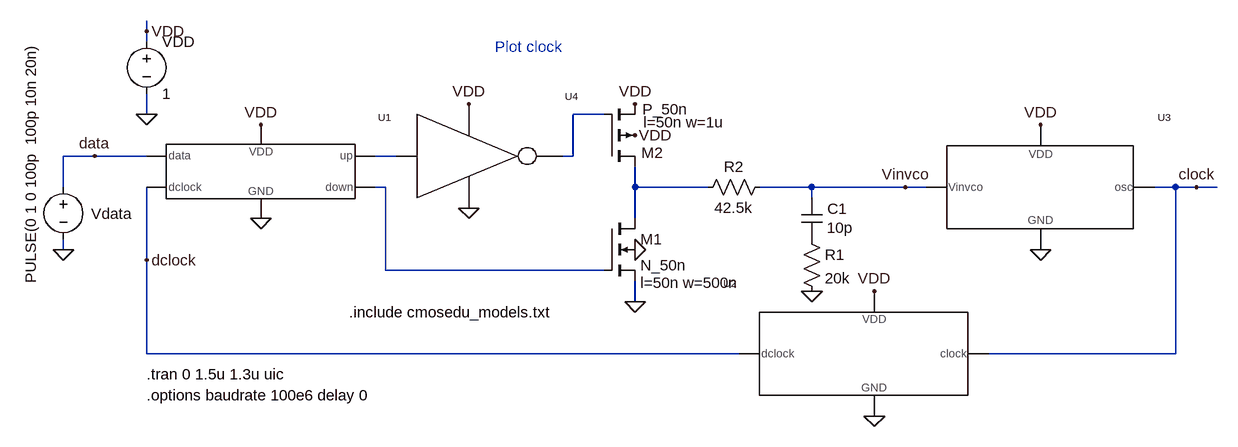
[diagram p0: schematic Fig19_35_eye_diagram.asc]
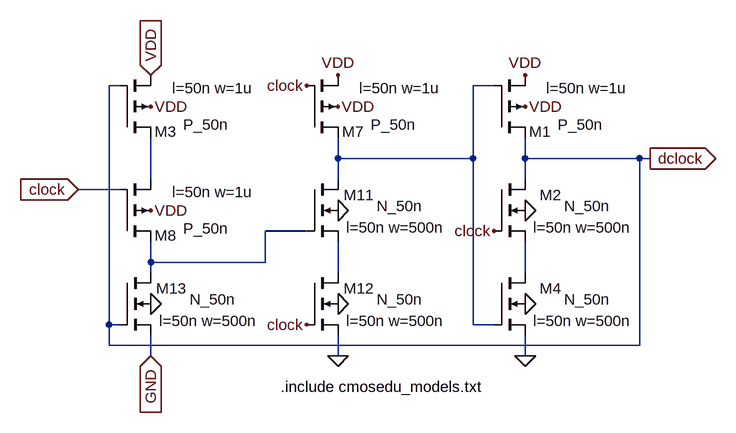
[diagram p1: sub-circuit divide_by_2.asc]
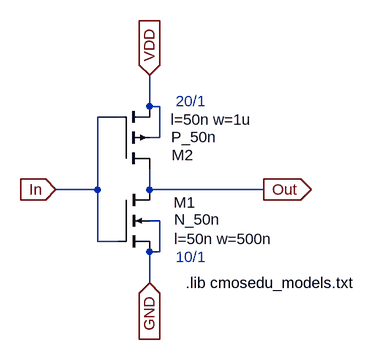
[diagram p2: sub-circuit inv_20_10.asc]
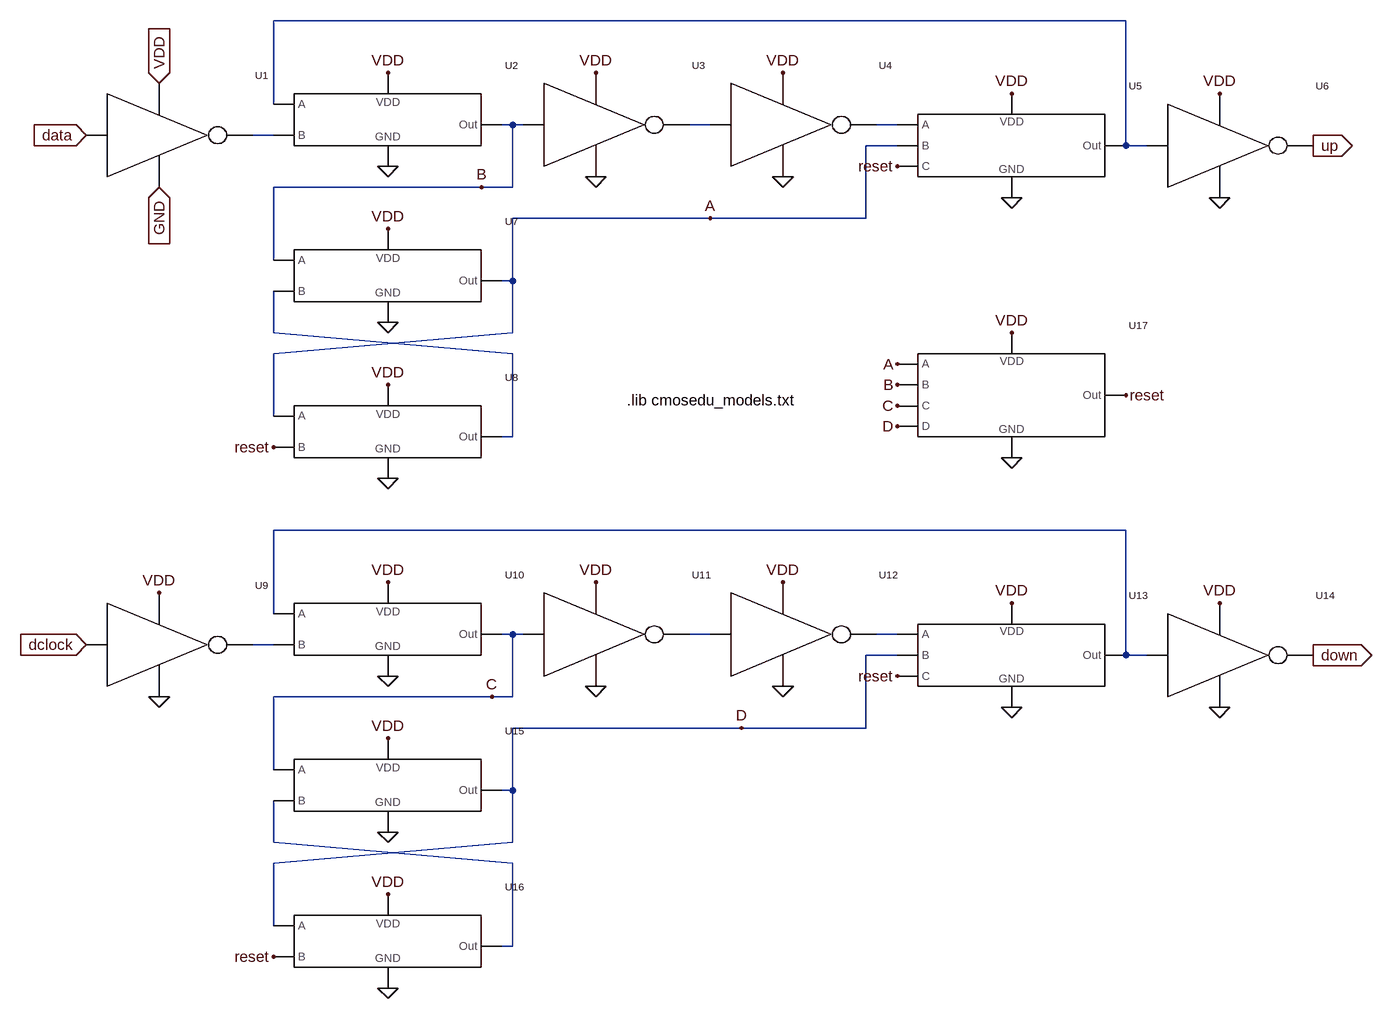
[diagram p3: sub-circuit pfd.asc]
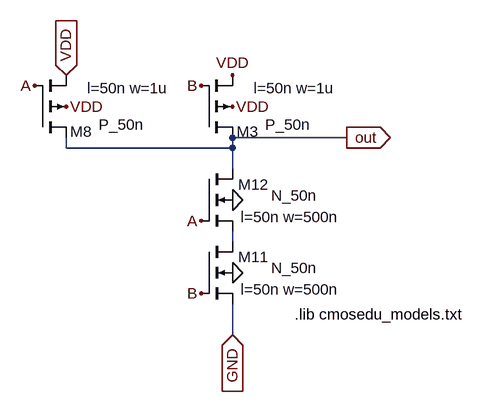
[diagram p4: sub-circuit nand_2.asc]
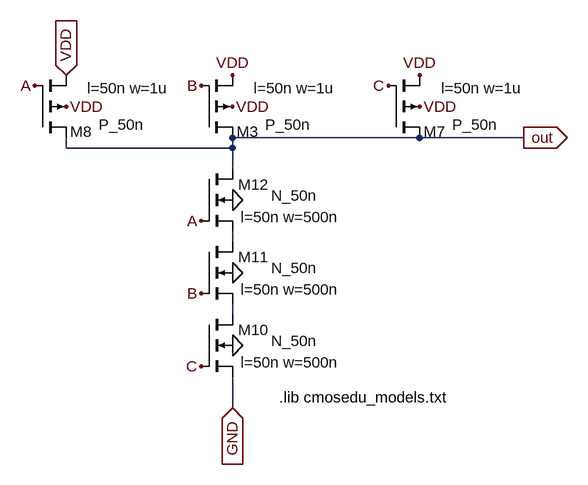
[diagram p5: sub-circuit nand_3.asc]
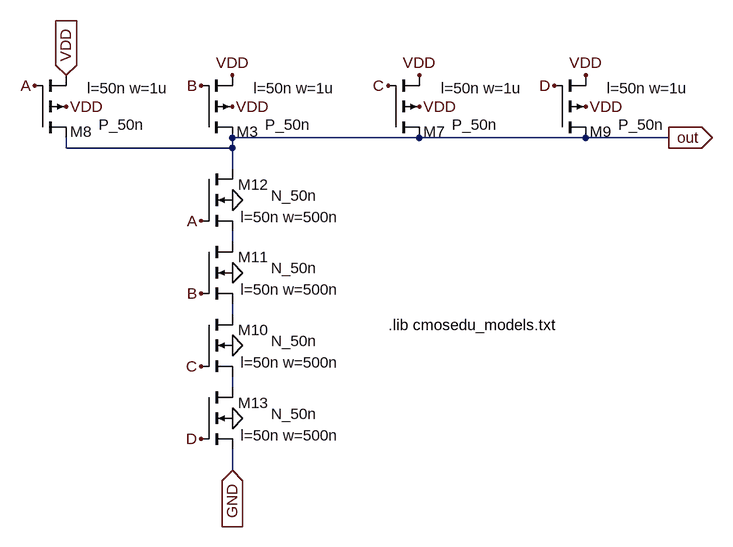
[diagram p6: sub-circuit nand_4.asc]
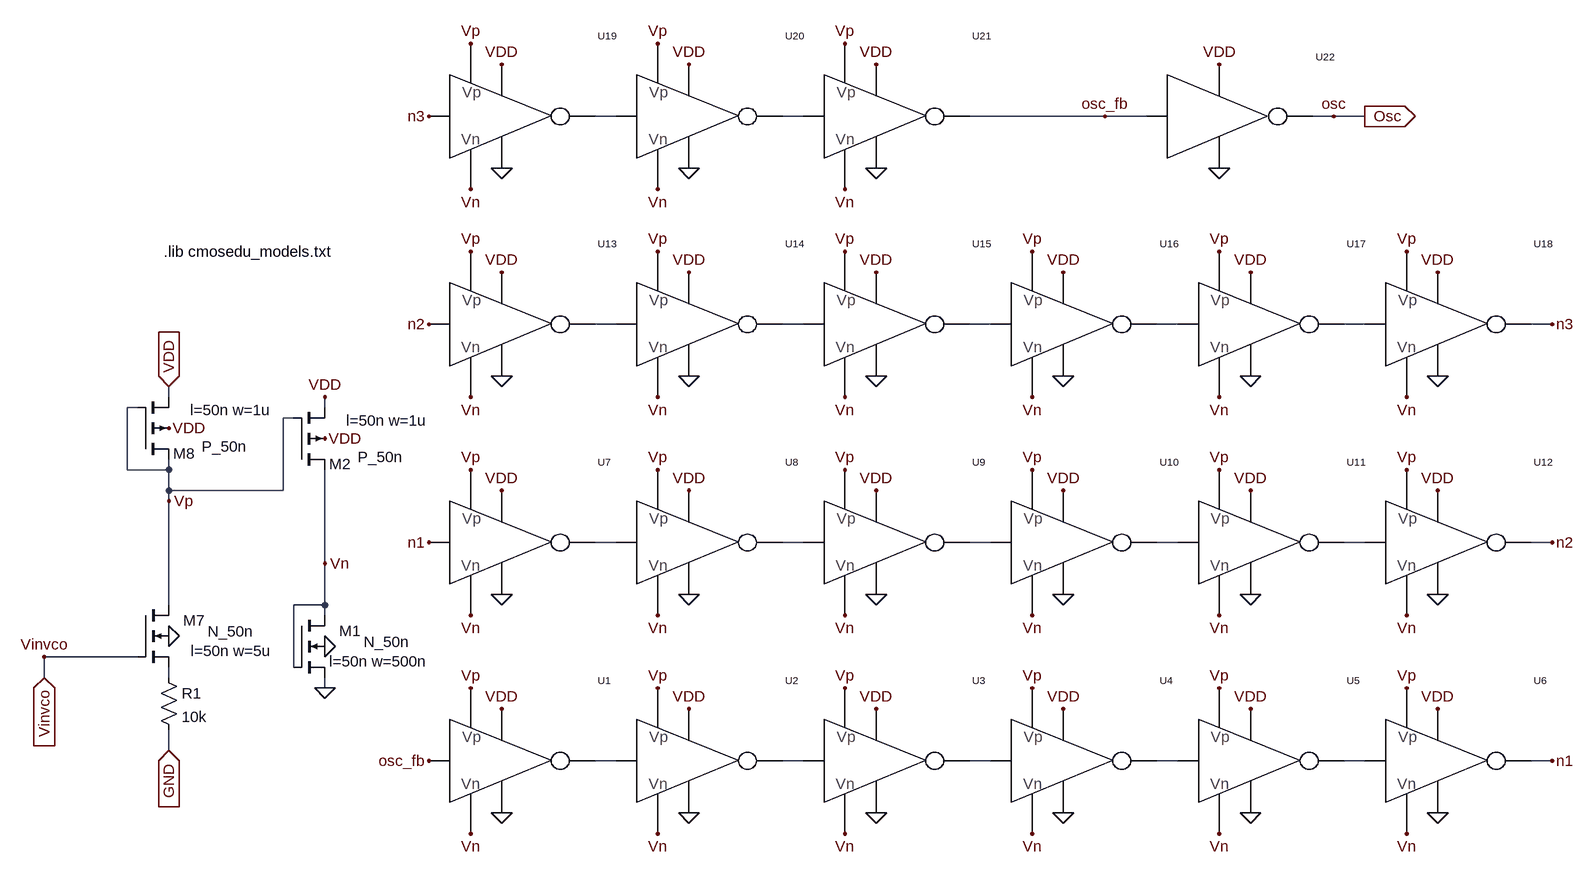
[diagram p7: sub-circuit vco_19_18.asc]
Fig19_35_eye_diagram.asc, the LTspice schematic file:
Version 4
SHEET 1 6288 680
WIRE 1232 -880 1232 -896
WIRE 1232 -864 1232 -880
WIRE 1232 -752 1232 -784
WIRE 1936 -752 1888 -752
WIRE 1152 -688 1104 -688
WIRE 1232 -688 1152 -688
WIRE 1616 -688 1584 -688
WIRE 1888 -688 1888 -752
WIRE 1888 -688 1872 -688
WIRE 1104 -640 1104 -688
WIRE 1600 -640 1584 -640
WIRE 1984 -640 1984 -672
WIRE 2096 -640 1984 -640
WIRE 2256 -640 2176 -640
WIRE 2400 -640 2256 -640
WIRE 2432 -640 2400 -640
WIRE 2816 -640 2784 -640
WIRE 2848 -640 2816 -640
WIRE 2880 -640 2848 -640
WIRE 2256 -624 2256 -640
WIRE 1984 -592 1984 -640
WIRE 1104 -544 1104 -560
WIRE 1232 -528 1232 -640
WIRE 1600 -512 1600 -640
WIRE 1936 -512 1600 -512
WIRE 1984 -464 1984 -496
WIRE 1232 -384 1232 -528
WIRE 2144 -384 1232 -384
WIRE 2816 -384 2816 -640
WIRE 2816 -384 2528 -384
FLAG 1104 -544 0
FLAG 1232 -752 0
FLAG 1232 -880 VDD
FLAG 1408 -736 VDD
FLAG 1408 -592 0
FLAG 1152 -688 data
FLAG 1232 -528 dclock
FLAG 2352 -480 VDD
FLAG 2352 -288 0
FLAG 2608 -544 0
FLAG 2608 -736 VDD
FLAG 2848 -640 clock
FLAG 2400 -640 Vinvco
FLAG 1728 -768 VDD
FLAG 1728 -608 0
FLAG 1984 -544 0
FLAG 1984 -464 0
FLAG 1984 -768 VDD
FLAG 1984 -720 VDD
FLAG 2256 -480 0
SYMBOL voltage 1104 -656 R0
WINDOW 0 43 57 Left 2
WINDOW 3 -50 164 VLeft 2
WINDOW 123 0 0 Left 2
WINDOW 39 0 0 Left 2
SYMATTR InstName Vdata
SYMATTR Value PULSE(0 1 0 100p  100p 10n 20n)
SYMBOL voltage 1232 -880 R0
WINDOW 123 0 0 Left 2
WINDOW 39 0 0 Left 2
SYMATTR InstName VDD
SYMATTR Value 1
SYMBOL divide_by_2 2576 -384 M0
SYMATTR InstName U2
SYMBOL INV_20_10 1648 -752 R0
SYMATTR InstName U4
SYMBOL PFD 1184 -640 R0
SYMATTR InstName U1
SYMBOL VCO_19_18 2384 -640 R0
SYMATTR InstName U3
SYMBOL nmos4 1936 -592 R0
WINDOW 123 56 99 Left 2
SYMATTR Value2 l=50n w=500n
SYMATTR InstName M1
SYMATTR Value N_50n
SYMBOL pmos4 1936 -672 M180
WINDOW 0 58 21 Left 2
WINDOW 3 59 88 Left 2
WINDOW 123 61 68 Left 2
SYMATTR InstName M2
SYMATTR Value P_50n
SYMATTR Value2 l=50n w=1u
SYMBOL cap 2240 -624 R0
WINDOW 0 40 17 Left 2
WINDOW 3 39 46 Left 2
SYMATTR InstName C1
SYMATTR Value 10p
SYMBOL res 2240 -576 R0
SYMATTR InstName R1
SYMATTR Value 20k
SYMBOL res 2192 -656 R90
WINDOW 0 0 56 VBottom 2
WINDOW 3 32 56 VTop 2
SYMATTR InstName R2
SYMATTR Value 42.5k
TEXT 1232 -352 Left 2 !.tran 0 1.5u 1.3u uic
TEXT 1768 -856 Left 2 ;Plot clock
TEXT 1544 -448 Left 2 !.include cmosedu_models.txt
TEXT 1232 -320 Left 2 !.options baudrate 100e6 delay 0

divide_by_2.asc, the sub-circuit schematic file:
Version 4
SHEET 1 6288 680
WIRE 1120 -496 1104 -496
WIRE 1696 -496 1664 -496
WIRE 1456 -384 1456 -416
WIRE 1664 -384 1664 -496
WIRE 1664 -384 1456 -384
WIRE 1744 -384 1744 -416
WIRE 1920 -384 1744 -384
WIRE 1936 -384 1920 -384
WIRE 1168 -352 1168 -416
WIRE 1456 -352 1456 -384
WIRE 1744 -352 1744 -384
WIRE 1120 -336 1056 -336
WIRE 1408 -272 1344 -272
WIRE 1168 -224 1168 -256
WIRE 1344 -224 1344 -272
WIRE 1344 -224 1168 -224
WIRE 1168 -208 1168 -224
WIRE 1456 -208 1456 -256
WIRE 1744 -208 1744 -256
WIRE 1104 -128 1104 -496
WIRE 1120 -128 1104 -128
WIRE 1664 -128 1664 -384
WIRE 1696 -128 1664 -128
WIRE 1104 -96 1104 -128
WIRE 1920 -96 1920 -384
WIRE 1920 -96 1104 -96
WIRE 1168 -80 1168 -112
WIRE 1456 -80 1456 -112
WIRE 1744 -80 1744 -112
FLAG 1168 -464 VDD
FLAG 1456 -80 0
FLAG 1456 -464 VDD
FLAG 1168 -304 VDD
FLAG 1456 -304 0
FLAG 1456 -160 0
FLAG 1168 -160 0
FLAG 1456 -512 VDD
FLAG 1168 -512 VDD
IOPIN 1168 -512 In
FLAG 1168 -80 GND
IOPIN 1168 -80 In
FLAG 1744 -80 0
FLAG 1744 -464 VDD
FLAG 1744 -304 0
FLAG 1744 -160 0
FLAG 1744 -512 VDD
FLAG 1936 -384 dclock
IOPIN 1936 -384 Out
FLAG 1056 -336 clock
IOPIN 1056 -336 In
FLAG 1408 -496 clock
FLAG 1408 -128 clock
FLAG 1696 -272 clock
SYMBOL pmos4 1120 -416 M180
WINDOW 0 88 9 Right 0
WINDOW 3 168 20 Right 0
WINDOW 123 206 76 Right 0
SYMATTR InstName M3
SYMATTR Value P_50n
SYMATTR Value2 l=50n w=1u
SYMBOL pmos4 1408 -416 M180
WINDOW 0 88 9 Right 0
WINDOW 3 168 20 Right 0
WINDOW 123 206 76 Right 0
SYMATTR InstName M7
SYMATTR Value P_50n
SYMATTR Value2 l=50n w=1u
SYMBOL pmos4 1120 -256 M180
WINDOW 0 88 9 Right 0
WINDOW 3 168 20 Right 0
WINDOW 123 206 76 Right 0
SYMATTR InstName M8
SYMATTR Value P_50n
SYMATTR Value2 l=50n w=1u
SYMBOL nmos4 1408 -352 R0
WINDOW 0 104 24 Right 0
WINDOW 3 179 41 Right 0
WINDOW 123 213 74 Right 0
SYMATTR InstName M11
SYMATTR Value N_50n
SYMATTR Value2 l=50n w=500n
SYMBOL nmos4 1408 -208 R0
WINDOW 0 104 24 Right 0
WINDOW 3 179 41 Right 0
WINDOW 123 213 74 Right 0
SYMATTR InstName M12
SYMATTR Value N_50n
SYMATTR Value2 l=50n w=500n
SYMBOL nmos4 1120 -208 R0
WINDOW 0 104 24 Right 0
WINDOW 3 179 41 Right 0
WINDOW 123 213 74 Right 0
SYMATTR InstName M13
SYMATTR Value N_50n
SYMATTR Value2 l=50n w=500n
SYMBOL pmos4 1696 -416 M180
WINDOW 0 88 9 Right 0
WINDOW 3 168 20 Right 0
WINDOW 123 206 76 Right 0
SYMATTR InstName M1
SYMATTR Value P_50n
SYMATTR Value2 l=50n w=1u
SYMBOL nmos4 1696 -352 R0
WINDOW 0 104 24 Right 0
WINDOW 3 179 41 Right 0
WINDOW 123 213 74 Right 0
SYMATTR InstName M2
SYMATTR Value N_50n
SYMATTR Value2 l=50n w=500n
SYMBOL nmos4 1696 -208 R0
WINDOW 0 104 24 Right 0
WINDOW 3 179 41 Right 0
WINDOW 123 213 74 Right 0
SYMATTR InstName M4
SYMATTR Value N_50n
SYMATTR Value2 l=50n w=500n
TEXT 1368 -32 Left 0 !.include cmosedu_models.txt

inv_20_10.asc, the sub-circuit schematic file:
Version 4
SHEET 1 1136 680
WIRE 448 -304 448 -352
WIRE 464 -304 448 -304
WIRE 400 -288 368 -288
WIRE 464 -256 464 -304
WIRE 464 -256 448 -256
WIRE 368 -176 368 -288
WIRE 368 -176 304 -176
WIRE 448 -176 448 -208
WIRE 624 -176 448 -176
WIRE 464 -128 448 -128
WIRE 368 -96 368 -176
WIRE 400 -96 368 -96
WIRE 464 -80 464 -128
WIRE 464 -80 448 -80
WIRE 448 -32 448 -80
FLAG 304 -176 In
IOPIN 304 -176 In
FLAG 448 -352 VDD
IOPIN 448 -352 In
FLAG 448 -32 GND
IOPIN 448 -32 In
FLAG 624 -176 Out
IOPIN 624 -176 Out
SYMBOL nmos4 400 -176 R0
WINDOW 0 119 20 Right 2
WINDOW 3 157 46 Right 2
WINDOW 123 238 76 Right 2
SYMATTR InstName M1
SYMATTR Value N_50n
SYMATTR Value2 l=50n w=500n
SYMBOL pmos4 400 -208 M180
WINDOW 0 116 21 Right 2
WINDOW 3 151 49 Right 2
WINDOW 123 206 76 Right 2
SYMATTR InstName M2
SYMATTR Value P_50n
SYMATTR Value2 l=50n w=1u
TEXT 488 -312 Left 2 ;20/1
TEXT 488 -72 Left 2 ;10/1
TEXT 504 -32 Left 2 !.lib cmosedu_models.txt

pfd.asc, the sub-circuit schematic file:
Version 4
SHEET 1 6296 1412
WIRE 1280 32 1280 -96
WIRE 1280 80 1248 80
WIRE 1280 272 1280 160
WIRE 1280 384 1280 320
WIRE 1280 512 1280 416
WIRE 1280 816 1280 688
WIRE 1280 864 1248 864
WIRE 1280 1056 1280 944
WIRE 1280 1168 1280 1104
WIRE 1280 1296 1280 1200
WIRE 1600 160 1280 160
WIRE 1616 944 1280 944
WIRE 1648 64 1632 64
WIRE 1648 160 1600 160
WIRE 1648 160 1648 64
WIRE 1648 304 1632 304
WIRE 1648 304 1648 208
WIRE 1648 384 1280 416
WIRE 1648 384 1648 304
WIRE 1648 416 1280 384
WIRE 1648 544 1632 544
WIRE 1648 544 1648 416
WIRE 1648 848 1632 848
WIRE 1648 944 1616 944
WIRE 1648 944 1648 848
WIRE 1648 1088 1632 1088
WIRE 1648 1088 1648 992
WIRE 1648 1168 1280 1200
WIRE 1648 1168 1648 1088
WIRE 1648 1200 1280 1168
WIRE 1648 1328 1632 1328
WIRE 1648 1328 1648 1200
WIRE 1664 64 1648 64
WIRE 1664 848 1648 848
WIRE 1952 64 1920 64
WIRE 1952 208 1648 208
WIRE 1952 848 1920 848
WIRE 2000 992 1648 992
WIRE 2192 208 1952 208
WIRE 2192 208 2192 96
WIRE 2192 992 2000 992
WIRE 2192 992 2192 880
WIRE 2240 64 2208 64
WIRE 2240 96 2192 96
WIRE 2240 848 2208 848
WIRE 2240 880 2192 880
WIRE 2592 -96 1280 -96
WIRE 2592 96 2592 -96
WIRE 2592 688 1280 688
WIRE 2592 880 2592 688
WIRE 2624 96 2592 96
WIRE 2624 880 2592 880
FLAG 1104 0 VDD
IOPIN 1104 0 In
FLAG 992 80 data
IOPIN 992 80 In
FLAG 1456 -16 VDD
FLAG 1456 128 0
FLAG 1776 144 0
FLAG 2064 144 0
FLAG 2416 16 VDD
FLAG 1776 -16 VDD
FLAG 2064 -16 VDD
FLAG 2416 176 0
FLAG 2736 176 0
FLAG 2736 16 VDD
FLAG 2880 96 up
IOPIN 2880 96 Out
FLAG 1456 368 0
FLAG 1456 608 0
FLAG 1456 224 VDD
FLAG 1456 464 VDD
FLAG 1280 560 reset
FLAG 1104 160 GND
IOPIN 1104 160 In
FLAG 992 864 dclock
IOPIN 992 864 In
FLAG 1456 768 VDD
FLAG 1456 912 0
FLAG 1776 928 0
FLAG 2064 928 0
FLAG 2416 800 VDD
FLAG 1776 768 VDD
FLAG 2064 768 VDD
FLAG 2416 960 0
FLAG 2736 960 0
FLAG 2736 800 VDD
FLAG 2880 880 down
IOPIN 2880 880 Out
FLAG 1456 1152 0
FLAG 1456 1392 0
FLAG 1456 1008 VDD
FLAG 1456 1248 VDD
FLAG 1280 1344 reset
FLAG 1104 944 0
FLAG 1104 784 VDD
FLAG 2240 128 reset
FLAG 2240 912 reset
FLAG 2592 480 reset
FLAG 2416 576 0
FLAG 2416 384 VDD
FLAG 1952 208 A
FLAG 1600 160 B
FLAG 1616 944 C
FLAG 2240 496 C
FLAG 2240 432 A
FLAG 2240 464 B
FLAG 2000 992 D
FLAG 2240 528 D
SYMBOL INV_20_10 1024 16 R0
SYMATTR InstName U1
SYMBOL NAND_2 1232 80 R0
SYMATTR InstName U2
SYMBOL INV_20_10 1696 0 R0
SYMATTR InstName U3
SYMBOL INV_20_10 1984 0 R0
SYMATTR InstName U4
SYMBOL NAND_3 2192 112 R0
SYMATTR InstName U5
SYMBOL INV_20_10 2656 32 R0
SYMATTR InstName U6
SYMBOL NAND_2 1232 320 R0
SYMATTR InstName U7
SYMBOL NAND_2 1232 560 R0
SYMATTR InstName U8
SYMBOL INV_20_10 1024 800 R0
SYMATTR InstName U9
SYMBOL NAND_2 1232 864 R0
SYMATTR InstName U10
SYMBOL INV_20_10 1696 784 R0
SYMATTR InstName U11
SYMBOL INV_20_10 1984 784 R0
SYMATTR InstName U12
SYMBOL NAND_3 2192 896 R0
SYMATTR InstName U13
SYMBOL INV_20_10 2656 816 R0
SYMATTR InstName U14
SYMBOL NAND_2 1232 1104 R0
SYMATTR InstName U15
SYMBOL NAND_2 1232 1344 R0
SYMATTR InstName U16
SYMBOL NAND_4 2192 480 R0
SYMATTR InstName U17
TEXT 1824 488 Left 0 !.lib cmosedu_models.txt

nand_2.asc, the sub-circuit schematic file:
Version 4
SHEET 1 6288 680
WIRE 912 -400 912 -416
WIRE 1168 -400 912 -400
WIRE 1168 -400 1168 -416
WIRE 1168 -368 1168 -400
WIRE 1168 -256 1168 -272
WIRE 1168 -112 1168 -160
WIRE 1344 -416 1168 -416
FLAG 1168 -464 VDD
FLAG 912 -464 VDD
FLAG 1168 -208 0
FLAG 1168 -320 0
FLAG 1168 -512 VDD
FLAG 912 -512 VDD
IOPIN 912 -512 In
FLAG 1168 -112 GND
IOPIN 1168 -112 In
FLAG 1344 -416 out
IOPIN 1344 -416 Out
FLAG 864 -496 A
FLAG 1120 -288 A
FLAG 1120 -496 B
FLAG 1120 -176 B
SYMBOL pmos4 1120 -416 M180
WINDOW 0 88 9 Right 0
WINDOW 3 168 20 Right 0
WINDOW 123 206 76 Right 0
SYMATTR InstName M3
SYMATTR Value P_50n
SYMATTR Value2 l=50n w=1u
SYMBOL pmos4 864 -416 M180
WINDOW 0 88 9 Right 0
WINDOW 3 168 20 Right 0
WINDOW 123 206 76 Right 0
SYMATTR InstName M8
SYMATTR Value P_50n
SYMATTR Value2 l=50n w=1u
SYMBOL nmos4 1120 -256 R0
WINDOW 0 104 24 Right 0
WINDOW 3 179 41 Right 0
WINDOW 123 213 74 Right 0
SYMATTR InstName M11
SYMATTR Value N_50n
SYMATTR Value2 l=50n w=500n
SYMBOL nmos4 1120 -368 R0
WINDOW 0 104 24 Right 0
WINDOW 3 179 41 Right 0
WINDOW 123 213 74 Right 0
SYMATTR InstName M12
SYMATTR Value N_50n
SYMATTR Value2 l=50n w=500n
TEXT 1264 -144 Left 0 !.lib cmosedu_models.txt

nand_3.asc, the sub-circuit schematic file:
Version 4
SHEET 1 6288 680
WIRE 912 -400 912 -416
WIRE 1168 -400 912 -400
WIRE 1168 -400 1168 -416
WIRE 1168 -368 1168 -400
WIRE 1168 -256 1168 -272
WIRE 1168 -144 1168 -160
WIRE 1168 0 1168 -48
WIRE 1456 -416 1168 -416
WIRE 1616 -416 1456 -416
FLAG 1168 -464 VDD
FLAG 1456 -464 VDD
FLAG 912 -464 VDD
FLAG 1168 -96 0
FLAG 1168 -208 0
FLAG 1168 -320 0
FLAG 1168 -512 VDD
FLAG 1456 -512 VDD
FLAG 912 -512 VDD
IOPIN 912 -512 In
FLAG 1168 0 GND
IOPIN 1168 0 In
FLAG 1616 -416 out
IOPIN 1616 -416 Out
FLAG 864 -496 A
FLAG 1120 -288 A
FLAG 1120 -496 B
FLAG 1120 -176 B
FLAG 1408 -496 C
FLAG 1120 -64 C
SYMBOL pmos4 1120 -416 M180
WINDOW 0 88 9 Right 0
WINDOW 3 168 20 Right 0
WINDOW 123 206 76 Right 0
SYMATTR InstName M3
SYMATTR Value P_50n
SYMATTR Value2 l=50n w=1u
SYMBOL pmos4 1408 -416 M180
WINDOW 0 88 9 Right 0
WINDOW 3 168 20 Right 0
WINDOW 123 206 76 Right 0
SYMATTR InstName M7
SYMATTR Value P_50n
SYMATTR Value2 l=50n w=1u
SYMBOL pmos4 864 -416 M180
WINDOW 0 88 9 Right 0
WINDOW 3 168 20 Right 0
WINDOW 123 206 76 Right 0
SYMATTR InstName M8
SYMATTR Value P_50n
SYMATTR Value2 l=50n w=1u
SYMBOL nmos4 1120 -144 R0
WINDOW 0 104 24 Right 0
WINDOW 3 179 41 Right 0
WINDOW 123 213 74 Right 0
SYMATTR InstName M10
SYMATTR Value N_50n
SYMATTR Value2 l=50n w=500n
SYMBOL nmos4 1120 -256 R0
WINDOW 0 104 24 Right 0
WINDOW 3 179 41 Right 0
WINDOW 123 213 74 Right 0
SYMATTR InstName M11
SYMATTR Value N_50n
SYMATTR Value2 l=50n w=500n
SYMBOL nmos4 1120 -368 R0
WINDOW 0 104 24 Right 0
WINDOW 3 179 41 Right 0
WINDOW 123 213 74 Right 0
SYMATTR InstName M12
SYMATTR Value N_50n
SYMATTR Value2 l=50n w=500n
TEXT 1240 -16 Left 0 !.lib cmosedu_models.txt

nand_4.asc, the sub-circuit schematic file:
Version 4
SHEET 1 6288 680
WIRE 912 -400 912 -416
WIRE 1168 -400 912 -400
WIRE 1168 -400 1168 -416
WIRE 1168 -368 1168 -400
WIRE 1168 -256 1168 -272
WIRE 1168 -144 1168 -160
WIRE 1168 -32 1168 -48
WIRE 1168 96 1168 64
WIRE 1456 -416 1168 -416
WIRE 1712 -416 1456 -416
WIRE 1840 -416 1712 -416
FLAG 1168 -464 VDD
FLAG 1456 -464 VDD
FLAG 912 -464 VDD
FLAG 1712 -464 VDD
FLAG 1168 -96 0
FLAG 1168 -208 0
FLAG 1168 -320 0
FLAG 1168 16 0
FLAG 1168 -512 VDD
FLAG 1456 -512 VDD
FLAG 1712 -512 VDD
FLAG 912 -512 VDD
IOPIN 912 -512 In
FLAG 1168 96 GND
IOPIN 1168 96 In
FLAG 1840 -416 out
IOPIN 1840 -416 Out
FLAG 864 -496 A
FLAG 1120 -288 A
FLAG 1120 -496 B
FLAG 1120 -176 B
FLAG 1408 -496 C
FLAG 1120 -64 C
FLAG 1664 -496 D
FLAG 1120 48 D
SYMBOL pmos4 1120 -416 M180
WINDOW 0 88 9 Right 0
WINDOW 3 168 20 Right 0
WINDOW 123 206 76 Right 0
SYMATTR InstName M3
SYMATTR Value P_50n
SYMATTR Value2 l=50n w=1u
SYMBOL pmos4 1408 -416 M180
WINDOW 0 88 9 Right 0
WINDOW 3 168 20 Right 0
WINDOW 123 206 76 Right 0
SYMATTR InstName M7
SYMATTR Value P_50n
SYMATTR Value2 l=50n w=1u
SYMBOL pmos4 864 -416 M180
WINDOW 0 88 9 Right 0
WINDOW 3 168 20 Right 0
WINDOW 123 206 76 Right 0
SYMATTR InstName M8
SYMATTR Value P_50n
SYMATTR Value2 l=50n w=1u
SYMBOL pmos4 1664 -416 M180
WINDOW 0 88 9 Right 0
WINDOW 3 168 20 Right 0
WINDOW 123 206 76 Right 0
SYMATTR InstName M9
SYMATTR Value P_50n
SYMATTR Value2 l=50n w=1u
SYMBOL nmos4 1120 -144 R0
WINDOW 0 104 24 Right 0
WINDOW 3 179 41 Right 0
WINDOW 123 213 74 Right 0
SYMATTR InstName M10
SYMATTR Value N_50n
SYMATTR Value2 l=50n w=500n
SYMBOL nmos4 1120 -256 R0
WINDOW 0 104 24 Right 0
WINDOW 3 179 41 Right 0
WINDOW 123 213 74 Right 0
SYMATTR InstName M11
SYMATTR Value N_50n
SYMATTR Value2 l=50n w=500n
SYMBOL nmos4 1120 -368 R0
WINDOW 0 104 24 Right 0
WINDOW 3 179 41 Right 0
WINDOW 123 213 74 Right 0
SYMATTR InstName M12
SYMATTR Value N_50n
SYMATTR Value2 l=50n w=500n
SYMBOL nmos4 1120 -32 R0
WINDOW 0 104 24 Right 0
WINDOW 3 179 41 Right 0
WINDOW 123 213 74 Right 0
SYMATTR InstName M13
SYMATTR Value N_50n
SYMATTR Value2 l=50n w=500n
TEXT 1408 -128 Left 0 !.lib cmosedu_models.txt

vco_19_18.asc, the sub-circuit schematic file:
Version 4
SHEET 1 6288 680
WIRE 416 -528 416 -560
WIRE 544 -848 544 -944
WIRE 560 -944 544 -944
WIRE 560 -560 416 -560
WIRE 608 -960 608 -976
WIRE 608 -848 544 -848
WIRE 608 -848 608 -864
WIRE 608 -816 608 -848
WIRE 608 -800 608 -816
WIRE 608 -640 608 -800
WIRE 608 -528 608 -544
WIRE 608 -416 608 -448
WIRE 784 -816 608 -816
WIRE 784 -816 784 -928
WIRE 800 -928 784 -928
WIRE 800 -544 800 -640
WIRE 848 -944 848 -960
WIRE 848 -704 848 -848
WIRE 848 -640 800 -640
WIRE 848 -640 848 -704
WIRE 848 -624 848 -640
WIRE 848 -512 848 -528
WIRE 1296 -1392 1264 -1392
WIRE 1296 -1072 1264 -1072
WIRE 1296 -736 1264 -736
WIRE 1296 -400 1264 -400
WIRE 1584 -1392 1552 -1392
WIRE 1584 -1072 1552 -1072
WIRE 1584 -736 1552 -736
WIRE 1584 -400 1552 -400
WIRE 1872 -1072 1840 -1072
WIRE 1872 -736 1840 -736
WIRE 1872 -400 1840 -400
WIRE 2048 -1392 1840 -1392
WIRE 2112 -1392 2048 -1392
WIRE 2160 -1072 2128 -1072
WIRE 2160 -736 2128 -736
WIRE 2160 -400 2128 -400
WIRE 2400 -1392 2368 -1392
WIRE 2448 -1392 2400 -1392
WIRE 2448 -1072 2416 -1072
WIRE 2448 -736 2416 -736
WIRE 2448 -400 2416 -400
WIRE 2736 -1072 2704 -1072
WIRE 2736 -736 2704 -736
WIRE 2736 -400 2704 -400
FLAG 416 -560 Vinvco
FLAG 608 -592 0
FLAG 608 -912 VDD
FLAG 608 -800 Vp
FLAG 1120 -480 VDD
FLAG 1120 -320 0
FLAG 1072 -512 Vp
FLAG 1072 -288 Vn
FLAG 1408 -480 VDD
FLAG 1408 -320 0
FLAG 1360 -512 Vp
FLAG 1360 -288 Vn
FLAG 1696 -480 VDD
FLAG 1696 -320 0
FLAG 1648 -512 Vp
FLAG 1648 -288 Vn
FLAG 1984 -480 VDD
FLAG 1984 -320 0
FLAG 1936 -512 Vp
FLAG 1936 -288 Vn
FLAG 2272 -480 VDD
FLAG 2272 -320 0
FLAG 2224 -512 Vp
FLAG 2224 -288 Vn
FLAG 2560 -480 VDD
FLAG 2560 -320 0
FLAG 2512 -512 Vp
FLAG 2512 -288 Vn
FLAG 1120 -816 VDD
FLAG 1120 -656 0
FLAG 1072 -848 Vp
FLAG 1072 -624 Vn
FLAG 1408 -816 VDD
FLAG 1408 -656 0
FLAG 1360 -848 Vp
FLAG 1360 -624 Vn
FLAG 1696 -816 VDD
FLAG 1696 -656 0
FLAG 1648 -848 Vp
FLAG 1648 -624 Vn
FLAG 1984 -816 VDD
FLAG 1984 -656 0
FLAG 1936 -848 Vp
FLAG 1936 -624 Vn
FLAG 2272 -816 VDD
FLAG 2272 -656 0
FLAG 2224 -848 Vp
FLAG 2224 -624 Vn
FLAG 2560 -816 VDD
FLAG 2560 -656 0
FLAG 2512 -848 Vp
FLAG 2512 -624 Vn
FLAG 1120 -1152 VDD
FLAG 1120 -992 0
FLAG 1072 -1184 Vp
FLAG 1072 -960 Vn
FLAG 1408 -1152 VDD
FLAG 1408 -992 0
FLAG 1360 -1184 Vp
FLAG 1360 -960 Vn
FLAG 1696 -1152 VDD
FLAG 1696 -992 0
FLAG 1648 -1184 Vp
FLAG 1648 -960 Vn
FLAG 1984 -1152 VDD
FLAG 1984 -992 0
FLAG 1936 -1184 Vp
FLAG 1936 -960 Vn
FLAG 2272 -1152 VDD
FLAG 2272 -992 0
FLAG 2224 -1184 Vp
FLAG 2224 -960 Vn
FLAG 2560 -1152 VDD
FLAG 2560 -992 0
FLAG 2512 -1184 Vp
FLAG 2512 -960 Vn
FLAG 1120 -1472 VDD
FLAG 1120 -1312 0
FLAG 1072 -1504 Vp
FLAG 1072 -1280 Vn
FLAG 1408 -1472 VDD
FLAG 1408 -1312 0
FLAG 1360 -1504 Vp
FLAG 1360 -1280 Vn
FLAG 1696 -1472 VDD
FLAG 1696 -1312 0
FLAG 1648 -1504 Vp
FLAG 1648 -1280 Vn
FLAG 2224 -1472 VDD
FLAG 2224 -1312 0
FLAG 2400 -1392 osc
FLAG 2048 -1392 osc_fb
FLAG 1008 -400 osc_fb
FLAG 2736 -400 n1
FLAG 1008 -736 n1
FLAG 2736 -736 n2
FLAG 1008 -1072 n2
FLAG 2736 -1072 n3
FLAG 1008 -1392 n3
FLAG 608 -976 VDD
IOPIN 608 -976 In
FLAG 608 -416 GND
IOPIN 608 -416 In
FLAG 416 -528 Vinvco
IOPIN 416 -528 In
FLAG 2448 -1392 Osc
IOPIN 2448 -1392 Out
FLAG 848 -576 0
FLAG 848 -896 VDD
FLAG 848 -960 VDD
FLAG 848 -512 0
FLAG 848 -704 Vn
SYMBOL nmos4 560 -640 R0
WINDOW 0 104 24 Right 0
WINDOW 3 179 41 Right 0
WINDOW 123 207 71 Right 0
SYMATTR InstName M7
SYMATTR Value N_50n
SYMATTR Value2 l=50n w=5u
SYMBOL pmos4 560 -864 M180
WINDOW 0 88 9 Right 0
WINDOW 3 168 20 Right 0
WINDOW 123 206 76 Right 0
SYMATTR InstName M8
SYMATTR Value P_50n
SYMATTR Value2 l=50n w=1u
SYMBOL CS_inv 1040 -464 R0
SYMATTR InstName U1
SYMBOL CS_inv 1328 -464 R0
SYMATTR InstName U2
SYMBOL CS_inv 1616 -464 R0
SYMATTR InstName U3
SYMBOL CS_inv 1904 -464 R0
SYMATTR InstName U4
SYMBOL CS_inv 2192 -464 R0
SYMATTR InstName U5
SYMBOL CS_inv 2480 -464 R0
SYMATTR InstName U6
SYMBOL CS_inv 1040 -800 R0
SYMATTR InstName U7
SYMBOL CS_inv 1328 -800 R0
SYMATTR InstName U8
SYMBOL CS_inv 1616 -800 R0
SYMATTR InstName U9
SYMBOL CS_inv 1904 -800 R0
SYMATTR InstName U10
SYMBOL CS_inv 2192 -800 R0
SYMATTR InstName U11
SYMBOL CS_inv 2480 -800 R0
SYMATTR InstName U12
SYMBOL CS_inv 1040 -1136 R0
SYMATTR InstName U13
SYMBOL CS_inv 1328 -1136 R0
SYMATTR InstName U14
SYMBOL CS_inv 1616 -1136 R0
SYMATTR InstName U15
SYMBOL CS_inv 1904 -1136 R0
SYMATTR InstName U16
SYMBOL CS_inv 2192 -1136 R0
SYMATTR InstName U17
SYMBOL CS_inv 2480 -1136 R0
SYMATTR InstName U18
SYMBOL CS_inv 1040 -1456 R0
SYMATTR InstName U19
SYMBOL CS_inv 1328 -1456 R0
SYMATTR InstName U20
SYMBOL CS_inv 1616 -1456 R0
SYMATTR InstName U21
SYMBOL INV_20_10 2144 -1456 R0
SYMATTR InstName U22
SYMBOL nmos4 800 -624 R0
WINDOW 0 104 24 Right 0
WINDOW 3 179 41 Right 0
WINDOW 123 207 71 Right 0
SYMATTR InstName M1
SYMATTR Value N_50n
SYMATTR Value2 l=50n w=500n
SYMBOL pmos4 800 -848 M180
WINDOW 0 88 9 Right 0
WINDOW 3 168 20 Right 0
WINDOW 123 206 76 Right 0
SYMATTR InstName M2
SYMATTR Value P_50n
SYMATTR Value2 l=50n w=1u
SYMBOL res 592 -544 R0
SYMATTR InstName R1
SYMATTR Value 10k
TEXT 600 -1184 Left 0 !.lib cmosedu_models.txt

cs_inv.asc, the sub-circuit schematic file:
Version 4
SHEET 1 6288 680
WIRE 656 -496 656 -512
WIRE 608 -480 544 -480
WIRE 656 -384 656 -400
WIRE 608 -288 608 -368
WIRE 608 -288 528 -288
WIRE 864 -288 656 -288
WIRE 912 -288 864 -288
WIRE 864 -240 864 -288
WIRE 608 -208 608 -288
WIRE 656 -176 656 -192
WIRE 864 -144 864 -176
WIRE 608 -96 544 -96
WIRE 656 -64 656 -80
FLAG 656 -128 0
FLAG 656 -448 VDD
FLAG 656 -336 VDD
FLAG 656 -240 0
FLAG 656 -512 VDD
IOPIN 656 -512 In
FLAG 528 -288 In
IOPIN 528 -288 In
FLAG 544 -480 Vp
IOPIN 544 -480 In
FLAG 544 -96 Vn
IOPIN 544 -96 In
FLAG 912 -288 Out
IOPIN 912 -288 Out
FLAG 656 -64 GND
IOPIN 656 -64 In
FLAG 864 -144 0
SYMBOL nmos4 608 -176 R0
WINDOW 0 104 24 Right 0
WINDOW 3 179 41 Right 0
WINDOW 123 213 74 Right 0
SYMATTR InstName M1
SYMATTR Value N_50n
SYMATTR Value2 l=50n w=500n
SYMBOL pmos4 608 -400 M180
WINDOW 0 88 9 Right 0
WINDOW 3 168 20 Right 0
WINDOW 123 206 76 Right 0
SYMATTR InstName M4
SYMATTR Value P_50n
SYMATTR Value2 l=50n w=1u
SYMBOL pmos4 608 -288 M180
WINDOW 0 88 9 Right 0
WINDOW 3 168 20 Right 0
WINDOW 123 206 76 Right 0
SYMATTR InstName M3
SYMATTR Value P_50n
SYMATTR Value2 l=50n w=1u
SYMBOL nmos4 608 -288 R0
WINDOW 0 104 24 Right 0
WINDOW 3 179 41 Right 0
WINDOW 123 213 74 Right 0
SYMATTR InstName M2
SYMATTR Value N_50n
SYMATTR Value2 l=50n w=500n
SYMBOL cap 848 -240 R0
SYMATTR InstName C1
SYMATTR Value 2f
TEXT 712 -56 Left 0 !.include cmosedu_models.txt
TEXT 912 -216 Left 0 ;model parasitic C\n(important)

The netlist it stands for:
* Fig19_35_eye_diagram.asc
Vdata data 0 PULSE(0 1 0 100p  100p 10n 20n)
VDD VDD 0 1
XU2 clock dclock VDD 0 divide_by_2
XU4 N002 N001 VDD 0 inv_20_10
XU1 data dclock N002 N003 VDD 0 pfd
XU3 Vinvco clock VDD 0 vco_19_18
M1 N004 N003 0 0 N_50n l=50n w=500n
M2 N004 N001 VDD VDD P_50n l=50n w=1u
C1 Vinvco P001 10p
R1 P001 0 20k
R2 Vinvco N004 42.5k

* block symbol definitions
.subckt divide_by_2 clock dclock VDD GND
M3 N002 dclock VDD VDD P_50n l=50n w=1u
M7 N001 clock VDD VDD P_50n l=50n w=1u
M8 N003 clock N002 VDD P_50n l=50n w=1u
M11 N001 N003 N004 0 N_50n l=50n w=500n
M12 N004 clock 0 0 N_50n l=50n w=500n
M13 N003 dclock GND 0 N_50n l=50n w=500n
M1 dclock N001 VDD VDD P_50n l=50n w=1u
M2 dclock clock N005 0 N_50n l=50n w=500n
M4 N005 N001 0 0 N_50n l=50n w=500n
.include cmosedu_models.txt
.ends divide_by_2

.subckt inv_20_10 In Out VDD GND
M1 Out In GND GND N_50n l=50n w=500n
M2 Out In VDD VDD P_50n l=50n w=1u
* 20/1
* 10/1
.lib cmosedu_models.txt
.ends inv_20_10

.subckt pfd data dclock up down VDD GND
XU1 data N002 VDD GND inv_20_10
XU2 N001 N002 B VDD 0 nand_2
XU3 B N007 VDD 0 inv_20_10
XU4 N007 N009 VDD 0 inv_20_10
XU5 N009 A reset N001 VDD 0 nand_3
XU6 N001 up VDD 0 inv_20_10
XU7 B N003 A VDD 0 nand_2
XU8 A reset N003 VDD 0 nand_2
XU9 dclock N005 VDD 0 inv_20_10
XU10 N004 N005 C VDD 0 nand_2
XU11 C N008 VDD 0 inv_20_10
XU12 N008 N010 VDD 0 inv_20_10
XU13 N010 D reset N004 VDD 0 nand_3
XU14 N004 down VDD 0 inv_20_10
XU15 C N006 D VDD 0 nand_2
XU16 D reset N006 VDD 0 nand_2
XU17 A B C D reset VDD 0 nand_4
.lib cmosedu_models.txt
.ends pfd

.subckt nand_2 A B Out VDD GND
M3 out B VDD VDD P_50n l=50n w=1u
M8 out A VDD VDD P_50n l=50n w=1u
M11 N001 B GND 0 N_50n l=50n w=500n
M12 out A N001 0 N_50n l=50n w=500n
.lib cmosedu_models.txt
.ends nand_2

.subckt nand_3 A B C Out VDD GND
M3 out B VDD VDD P_50n l=50n w=1u
M7 out C VDD VDD P_50n l=50n w=1u
M8 out A VDD VDD P_50n l=50n w=1u
M10 N002 C GND 0 N_50n l=50n w=500n
M11 N001 B N002 0 N_50n l=50n w=500n
M12 out A N001 0 N_50n l=50n w=500n
.lib cmosedu_models.txt
.ends nand_3

.subckt nand_4 A B C D Out VDD GND
M3 out B VDD VDD P_50n l=50n w=1u
M7 out C VDD VDD P_50n l=50n w=1u
M8 out A VDD VDD P_50n l=50n w=1u
M9 out D VDD VDD P_50n l=50n w=1u
M10 N002 C N003 0 N_50n l=50n w=500n
M11 N001 B N002 0 N_50n l=50n w=500n
M12 out A N001 0 N_50n l=50n w=500n
M13 N003 D GND 0 N_50n l=50n w=500n
.lib cmosedu_models.txt
.ends nand_4

.subckt vco_19_18 Vinvco osc VDD GND
M7 Vp Vinvco N001 0 N_50n l=50n w=5u
M8 Vp Vp VDD VDD P_50n l=50n w=1u
XU1 osc_fb N005 Vp Vn VDD 0 cs_inv
XU2 N005 N009 Vp Vn VDD 0 cs_inv
XU3 N009 N012 Vp Vn VDD 0 cs_inv
XU4 N012 N015 Vp Vn VDD 0 cs_inv
XU5 N015 N018 Vp Vn VDD 0 cs_inv
XU6 N018 n1 Vp Vn VDD 0 cs_inv
XU7 n1 N004 Vp Vn VDD 0 cs_inv
XU8 N004 N008 Vp Vn VDD 0 cs_inv
XU9 N008 N011 Vp Vn VDD 0 cs_inv
XU10 N011 N014 Vp Vn VDD 0 cs_inv
XU11 N014 N017 Vp Vn VDD 0 cs_inv
XU12 N017 n2 Vp Vn VDD 0 cs_inv
XU13 n2 N003 Vp Vn VDD 0 cs_inv
XU14 N003 N007 Vp Vn VDD 0 cs_inv
XU15 N007 N010 Vp Vn VDD 0 cs_inv
XU16 N010 N013 Vp Vn VDD 0 cs_inv
XU17 N013 N016 Vp Vn VDD 0 cs_inv
XU18 N016 n3 Vp Vn VDD 0 cs_inv
XU19 n3 N002 Vp Vn VDD 0 cs_inv
XU20 N002 N006 Vp Vn VDD 0 cs_inv
XU21 N006 osc_fb Vp Vn VDD 0 cs_inv
XU22 osc_fb osc VDD 0 inv_20_10
M1 Vn Vn 0 0 N_50n l=50n w=500n
M2 Vn Vp VDD VDD P_50n l=50n w=1u
R1 N001 GND 10k
.lib cmosedu_models.txt
.ends vco_19_18

.subckt cs_inv In Out Vp Vn VDD GND
M1 N002 Vn GND 0 N_50n l=50n w=500n
M4 N001 Vp VDD VDD P_50n l=50n w=1u
M3 Out In N001 VDD P_50n l=50n w=1u
M2 Out In N002 0 N_50n l=50n w=500n
C1 Out 0 2f
.include cmosedu_models.txt
* model parasitic C
* (important)
.ends cs_inv

.model NMOS NMOS
.model PMOS PMOS
.lib standard.mos
.tran 0 1.5u 1.3u uic
* Plot clock
.include cmosedu_models.txt
.options baudrate 100e6 delay 0
.backanno
.end